# EAGLE design WFBOK_QSB_Rev_2 (EAGLE 9.6.2)
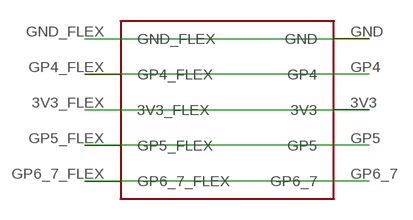
[diagram p0: schematic, sheet 1]

## Parts
U$1  WFBOK_QSB_REV_2  [WFBOK_QSB_REV_2]

## Nets
N$1: U$1.GND U$1.GND_FLEX
N$2: U$1.GP4 U$1.GP4_FLEX
N$3: U$1.3V3 U$1.3V3_FLEX
N$4: U$1.GP5 U$1.GP5_FLEX
N$5: U$1.GP6_7 U$1.GP6_7_FLEX

## Library data of the parts
U$1 = WFBOK_QSB_REV_2:WFBOK_QSB_REV_2

## Board
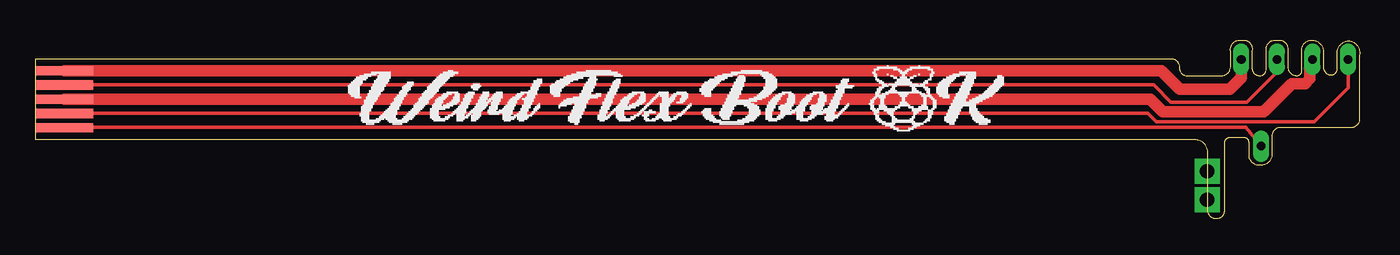
[diagram p1: board, top side]
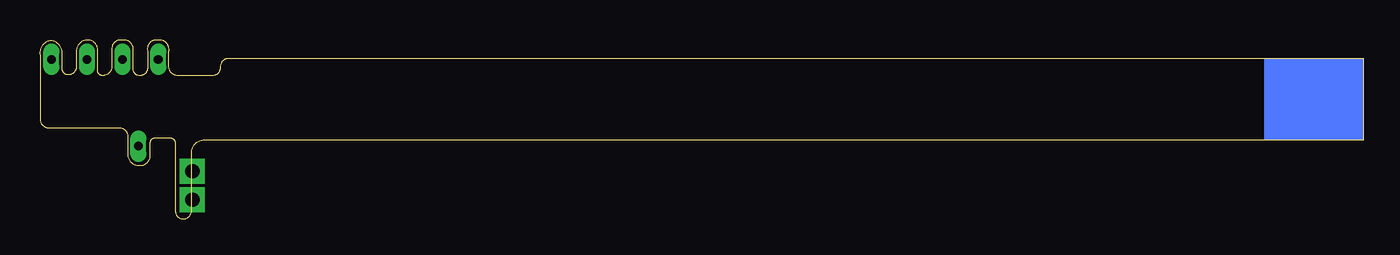
[diagram p2: board, bottom side, seen from below]

Size 92.96 x 12.55 mm. Coordinates in mm from the lower left corner, seen from the top.
Outline: 0,11.25 79.7,11.25 arc-90 80.3,10.65 80.3,10.6 arc90 80.85,10.05 83.25,10.05 arc90 83.9,10.7 83.9,11.75 arc-90 84.45,12.55 84.9,12.55 arc-90 85.4,11.8 85.4,10.6 arc90 85.95,10.05 arc90 86.4,10.5 86.4,11.75 arc-90 86.95,12.55 87.4,12.55 arc-90 87.9,11.85 87.9,10.75 arc90 88.55,10.05 arc90 88.9,10.4 88.9,11.7 arc-90 89.5,12.55 89.7,12.55 arc-90 90.4,11.65 90.4,10.7 arc90 90.95,10.1 arc90 91.4,10.55 91.4,11.5 arc-90 92.1,12.5 92.25,12.5 arc-90 92.95,11.5 92.95,7 arc-90 92.35,6.4 87.35,6.4 arc90 86.8,5.8 86.8,4.65 arc-90 86.1,3.75 85.9,3.75 arc-90 85.2,4.45 85.2,5.35 arc90 84.85,5.7 83.85,5.7 arc90 83.45,5.3 83.45,0.55 arc-90 82.9,0 arc-90 82.3,0.6 82.3,4.65 arc90 81.4,5.55 0,5.55 0,11.25
Copper layers (1*16): Top 0.035mm / dielectric 1.5mm / Bottom 0.035mm
Design rules "default *": minimum track width 6mil, minimum drill 0.35mm, track to track 6mil, track to pad 6mil, pad to pad 6mil, via to via 6mil, smd to smd 6mil, copper to edge 6mil, drill to drill 6mil, minimum pad ring 10mil, minimum via ring 8mil, stop-mask expansion 4mil, vias tented up to drill 0mil, thermal gap 10mil

### Footprints (pad centres in the part's own frame; a part is rotated, then mirrored left to right if it is on the bottom)
WFBOK_QSB_REV_2 = drill 0.6 pad 1 long: 3V3 5.6,1.3; GND 0.6,1.3; GP4 3.1,1.3; GP5 8.1,1.3; GP6_7 2,-4.8 | smd 4 x 0.65: 3V3_FLEX -82,-1.5; GND_FLEX -82,0.5; GP4_FLEX -82,-0.5; GP5_FLEX -82,-2.5; GP6_7_FLEX -82,-3.5 | drill 1 pad 1.75 square: P$1 -1.8,-6.55; P$2 -1.8,-8.55

### Placement (x,y rotation side)
U$1  84.05,9.9 0 top
U$2  [SCREENSHOT_FROM_2022#08#13_20#29#30#PNG]  44.95,8.35 0 top

### Tracks (layer width: path | path; a pad name or v marks a point on that pad's centre or on a via)
N$1
  Top 0.813: U$1.GND_FLEX 79.05,10.4 80.35,9.1 83.85,9.1 84.65,9.9 U$1.GND
N$2
  Top 0.254: U$1.GP4 87.15,10.3 85.05,8.2 79.7,8.2 78.5,9.4 U$1.GP4_FLEX
N$3
  Top 0.813: U$1.3V3 89.46,10.76 89.46,9.82 89.13,9.49 88.19,9.49 86.21,7.51 79.14,7.51 78.25,8.4 U$1.3V3_FLEX
N$4
  Top 0.254: U$1.GP5 92.15,9.2 89.78,6.83 78.67,6.83 78.1,7.4 U$1.GP5_FLEX
N$5
  Top 0.254: U$1.GP6_7 84.98,6.42 2.07,6.42 U$1.GP6_7_FLEX
(copper drawn outside any net)
  shapes: Bottom area x1

### Text on the board
Document: Bottom Stiffner